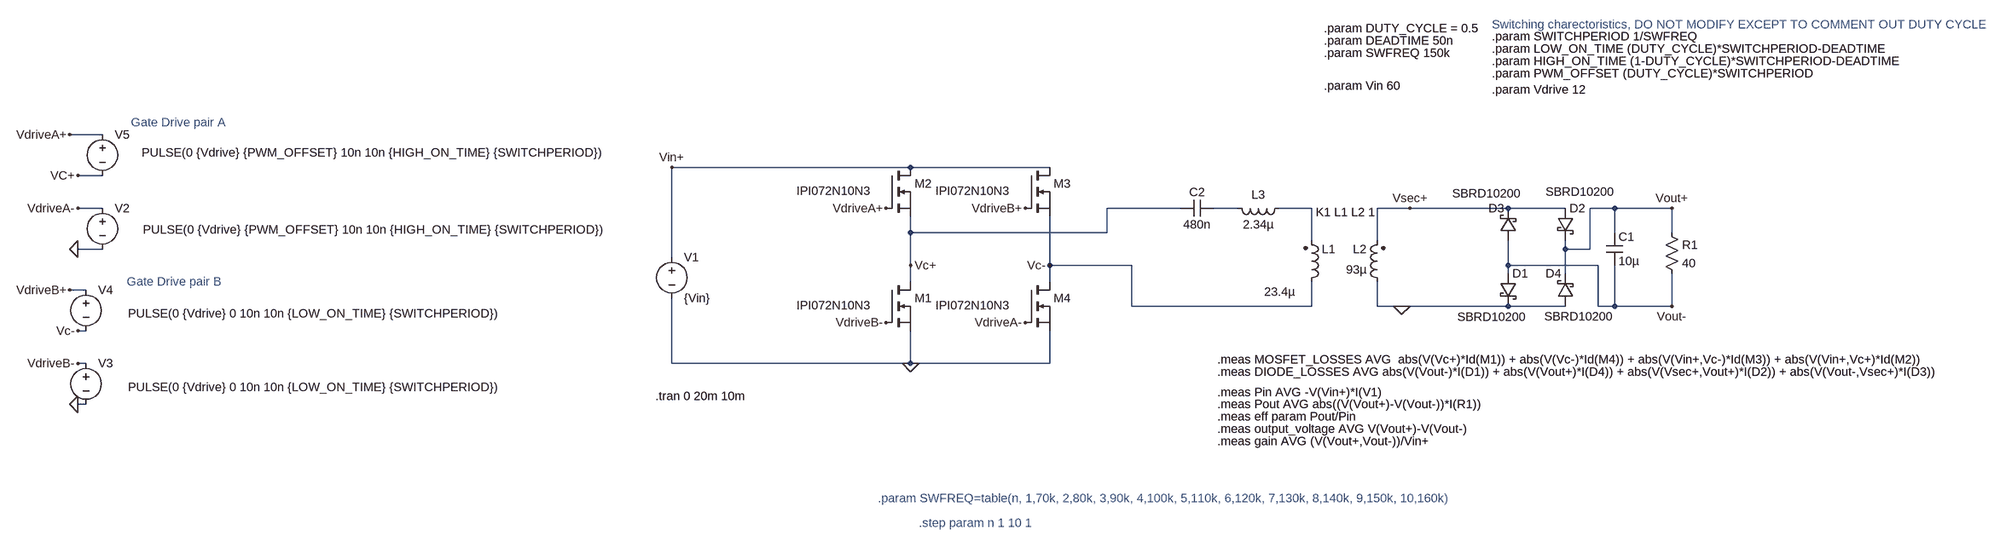
[diagram p0: schematic resonant_full_bridge_ln_10.asc]
resonant_full_bridge_ln_10.asc, the LTspice schematic file:
Version 4
SHEET 1 2776 680
WIRE -2768 -1168 -2832 -1168
WIRE -960 -1104 -1520 -1104
WIRE -688 -1104 -960 -1104
WIRE -2768 -1088 -2816 -1088
WIRE -2768 -1024 -2816 -1024
WIRE -432 -1024 -576 -1024
WIRE -320 -1024 -368 -1024
WIRE -176 -1024 -240 -1024
WIRE 16 -1024 -48 -1024
WIRE 208 -1024 16 -1024
WIRE 320 -1024 208 -1024
WIRE 416 -1024 368 -1024
WIRE 528 -1024 416 -1024
WIRE -960 -976 -960 -1008
WIRE -576 -976 -576 -1024
WIRE -576 -976 -960 -976
WIRE 416 -976 416 -1024
WIRE 528 -976 528 -1024
WIRE -176 -960 -176 -1024
WIRE -48 -960 -48 -1024
WIRE -2768 -944 -2816 -944
WIRE 320 -944 320 -960
WIRE 368 -944 368 -1024
WIRE 368 -944 320 -944
WIRE -1520 -928 -1520 -1104
WIRE -960 -912 -960 -976
WIRE -688 -912 -688 -1008
WIRE -528 -912 -688 -912
WIRE 208 -912 208 -960
WIRE 384 -912 208 -912
WIRE 208 -896 208 -912
WIRE 320 -896 320 -944
WIRE -960 -880 -960 -912
WIRE -688 -880 -688 -912
WIRE -2800 -864 -2832 -864
WIRE -528 -832 -528 -912
WIRE -176 -832 -176 -880
WIRE -176 -832 -528 -832
WIRE -48 -832 -48 -880
WIRE 0 -832 -48 -832
WIRE 208 -832 0 -832
WIRE 320 -832 208 -832
WIRE 384 -832 384 -912
WIRE 416 -832 416 -912
WIRE 416 -832 384 -832
WIRE 528 -832 528 -896
WIRE 528 -832 416 -832
WIRE -2800 -784 -2816 -784
WIRE -2800 -720 -2816 -720
WIRE -1520 -720 -1520 -848
WIRE -960 -720 -960 -784
WIRE -960 -720 -1520 -720
WIRE -688 -720 -688 -784
WIRE -688 -720 -960 -720
WIRE -2800 -640 -2816 -640
FLAG -960 -720 0
FLAG 0 -832 0
FLAG -1520 -1104 Vin+
FLAG 528 -1024 Vout+
FLAG 528 -832 Vout-
FLAG -960 -912 Vc+
FLAG -1008 -1024 VdriveA+
FLAG -736 -800 VdriveA-
FLAG -1008 -800 VdriveB-
FLAG -736 -1024 VdriveB+
FLAG -2816 -640 0
FLAG -2816 -944 0
FLAG -688 -912 Vc-
FLAG -2816 -784 Vc-
FLAG -2816 -1088 VC+
FLAG -2832 -1168 VdriveA+
FLAG -2816 -1024 VdriveA-
FLAG -2816 -720 VdriveB-
FLAG -2832 -864 VdriveB+
FLAG 16 -1024 Vsec+
SYMBOL voltage -1520 -944 R0
WINDOW 123 0 0 Left 0
WINDOW 39 0 0 Left 0
SYMATTR InstName V1
SYMATTR Value {Vin}
SYMBOL nmos -1008 -1104 R0
WINDOW 3 -175 46 Left 2
SYMATTR Value IPI072N10N3
SYMATTR InstName M2
SYMBOL res 512 -992 R0
SYMATTR InstName R1
SYMATTR Value 40
SYMBOL cap 400 -976 R0
SYMATTR InstName C1
SYMATTR Value 10µ
SYMBOL cap -368 -1040 R90
WINDOW 0 0 32 VBottom 2
WINDOW 3 32 32 VTop 2
SYMATTR InstName C2
SYMATTR Value 480n
SYMBOL ind2 -192 -864 M180
WINDOW 0 36 80 Left 2
WINDOW 3 -77 -4 Left 2
SYMATTR InstName L1
SYMATTR Value 23.4µ
SYMATTR Type ind
SYMBOL ind2 -32 -864 R180
WINDOW 0 36 80 Left 2
WINDOW 3 36 40 Left 2
SYMATTR InstName L2
SYMATTR Value 93µ
SYMATTR Type ind
SYMBOL ind -224 -1040 R90
WINDOW 0 5 56 VBottom 2
WINDOW 3 32 56 VTop 2
SYMATTR InstName L3
SYMATTR Value 2.34µ
SYMBOL voltage -2768 -1040 R0
WINDOW 3 79 58 Left 2
WINDOW 123 0 0 Left 0
WINDOW 39 0 0 Left 0
SYMATTR Value PULSE(0 {Vdrive} {PWM_OFFSET} 10n 10n {HIGH_ON_TIME} {SWITCHPERIOD})
SYMATTR InstName V2
SYMBOL voltage -2800 -736 R0
WINDOW 3 82 62 Left 2
WINDOW 123 0 0 Left 0
WINDOW 39 0 0 Left 0
SYMATTR Value PULSE(0 {Vdrive} 0 10n 10n {LOW_ON_TIME} {SWITCHPERIOD})
SYMATTR InstName V3
SYMBOL nmos -1008 -880 R0
WINDOW 3 -175 46 Left 2
SYMATTR Value IPI072N10N3
SYMATTR InstName M1
SYMBOL nmos -736 -1104 R0
WINDOW 3 -175 46 Left 2
SYMATTR Value IPI072N10N3
SYMATTR InstName M3
SYMBOL nmos -736 -880 R0
WINDOW 3 -175 46 Left 2
SYMATTR Value IPI072N10N3
SYMATTR InstName M4
SYMBOL voltage -2800 -880 R0
WINDOW 3 82 62 Left 2
WINDOW 123 0 0 Left 0
WINDOW 39 0 0 Left 0
SYMATTR Value PULSE(0 {Vdrive} 0 10n 10n {LOW_ON_TIME} {SWITCHPERIOD})
SYMATTR InstName V4
SYMBOL voltage -2768 -1184 R0
WINDOW 3 77 51 Left 2
WINDOW 123 0 0 Left 0
WINDOW 39 0 0 Left 0
SYMATTR Value PULSE(0 {Vdrive} {PWM_OFFSET} 10n 10n {HIGH_ON_TIME} {SWITCHPERIOD})
SYMATTR InstName V5
SYMBOL schottky 224 -960 R180
WINDOW 3 -8 93 Left 2
WINDOW 0 24 64 Left 2
SYMATTR Value SBRD10200
SYMATTR InstName D3
SYMATTR Description Diode
SYMATTR Type diode
SYMATTR SpiceLine Bv=200
SYMBOL schottky 192 -896 R0
WINDOW 3 87 84 Left 2
SYMATTR Value SBRD10200
SYMATTR InstName D1
SYMATTR Description Diode
SYMATTR Type diode
SYMATTR SpiceLine Bv=200
SYMBOL schottky 304 -1024 R0
WINDOW 3 -23 -32 Left 2
SYMATTR Value SBRD10200
SYMATTR InstName D2
SYMATTR Description Diode
SYMATTR Type diode
SYMATTR SpiceLine Bv=200
SYMBOL schottky 336 -832 R180
WINDOW 3 94 -21 Left 2
WINDOW 0 24 64 Left 2
SYMATTR Value SBRD10200
SYMATTR InstName D4
SYMATTR Description Diode
SYMATTR Type diode
SYMATTR SpiceLine Bv=200
TEXT -152 -1352 Left 2 !.param DEADTIME 50n
TEXT -152 -1328 Left 2 !.param SWFREQ 150k
TEXT 176 -1360 Left 2 !.param SWITCHPERIOD 1/SWFREQ
TEXT 176 -1336 Left 2 !.param LOW_ON_TIME (DUTY_CYCLE)*SWITCHPERIOD-DEADTIME
TEXT 176 -1312 Left 2 !.param HIGH_ON_TIME (1-DUTY_CYCLE)*SWITCHPERIOD-DEADTIME
TEXT 176 -1288 Left 2 !.param PWM_OFFSET (DUTY_CYCLE)*SWITCHPERIOD
TEXT -152 -1264 Left 2 !.param Vin 60
TEXT -152 -1376 Left 2 !.param DUTY_CYCLE = 0.5
TEXT 176 -1384 Left 2 ;Switching charectoristics, DO NOT MODIFY EXCEPT TO COMMENT OUT DUTY CYCLE
TEXT -168 -1016 Left 2 !K1 L1 L2 1
TEXT 176 -1256 Left 2 !.param Vdrive 12
TEXT -1552 -656 Left 2 !.tran 0 20m 10m
TEXT -944 -408 Left 2 ;.step param n 1 10 1
TEXT -1024 -456 Left 2 ;.param SWFREQ=table(n, 1,70k, 2,80k, 3,90k, 4,100k, 5,110k, 6,120k, 7,130k, 8,140k, 9,150k, 10,160k)
TEXT -360 -664 Left 2 !.meas Pin AVG -V(Vin+)*I(V1)
TEXT -360 -640 Left 2 !.meas Pout AVG abs((V(Vout+)-V(Vout-))*I(R1))
TEXT -360 -616 Left 2 !.meas eff param Pout/Pin
TEXT -2712 -1192 Left 2 ;Gate Drive pair A
TEXT -2720 -880 Left 2 ;Gate Drive pair B
TEXT -360 -704 Left 2 !.meas DIODE_LOSSES AVG abs(V(Vout-)*I(D1)) + abs(V(Vout+)*I(D4)) + abs(V(Vsec+,Vout+)*I(D2)) + abs(V(Vout-,Vsec+)*I(D3))
TEXT -360 -728 Left 2 !.meas MOSFET_LOSSES AVG  abs(V(Vc+)*Id(M1)) + abs(V(Vc-)*Id(M4)) + abs(V(Vin+,Vc-)*Id(M3)) + abs(V(Vin+,Vc+)*Id(M2))
TEXT -360 -592 Left 2 !.meas output_voltage AVG V(Vout+)-V(Vout-)
TEXT -360 -568 Left 2 !.meas gain AVG (V(Vout+,Vout-))/Vin+

The netlist it stands for:
* resonant_full_bridge_ln_10.asc
V1 Vin+ 0 {Vin}
M2 Vin+ VdriveA+ Vc+ Vc+ IPI072N10N3
R1 Vout+ Vout- 40
C1 Vout+ Vout- 10µ
C2 N001 Vc+ 480n
L1 Vc- N002 23.4µ
L2 0 Vsec+ 93µ
L3 N002 N001 2.34µ
V2 VdriveA- 0 PULSE(0 {Vdrive} {PWM_OFFSET} 10n 10n {HIGH_ON_TIME} {SWITCHPERIOD})
V3 VdriveB- 0 PULSE(0 {Vdrive} 0 10n 10n {LOW_ON_TIME} {SWITCHPERIOD})
M1 Vc+ VdriveB- 0 0 IPI072N10N3
M3 Vin+ VdriveB+ Vc- Vc- IPI072N10N3
M4 Vc- VdriveA- 0 0 IPI072N10N3
V4 VdriveB+ Vc- PULSE(0 {Vdrive} 0 10n 10n {LOW_ON_TIME} {SWITCHPERIOD})
V5 VdriveA+ Vc+ PULSE(0 {Vdrive} {PWM_OFFSET} 10n 10n {HIGH_ON_TIME} {SWITCHPERIOD})
D3 Vout- Vsec+ SBRD10200 Bv=200
D1 Vout- 0 SBRD10200 Bv=200
D2 Vsec+ Vout+ SBRD10200 Bv=200
D4 0 Vout+ SBRD10200 Bv=200
.model D D
.lib standard.dio
.model NMOS NMOS
.model PMOS PMOS
.lib standard.mos
.param DEADTIME 50n
.param SWFREQ 150k
.param SWITCHPERIOD 1/SWFREQ
.param LOW_ON_TIME (DUTY_CYCLE)*SWITCHPERIOD-DEADTIME
.param HIGH_ON_TIME (1-DUTY_CYCLE)*SWITCHPERIOD-DEADTIME
.param PWM_OFFSET (DUTY_CYCLE)*SWITCHPERIOD
.param Vin 60
.param DUTY_CYCLE = 0.5
* Switching charectoristics, DO NOT MODIFY EXCEPT TO COMMENT OUT DUTY CYCLE
K1 L1 L2 1
.param Vdrive 12
.tran 0 20m 10m
* .step param n 1 10 1
* .param SWFREQ=table(n, 1,70k, 2,80k, 3,90k, 4,100k, 5,110k, 6,120k, 7,130k, 8,140k, 9,150k, 10,160k)
.meas Pin AVG -V(Vin+)*I(V1)
.meas Pout AVG abs((V(Vout+)-V(Vout-))*I(R1))
.meas eff param Pout/Pin
* Gate Drive pair A
* Gate Drive pair B
.meas DIODE_LOSSES AVG abs(V(Vout-)*I(D1)) + abs(V(Vout+)*I(D4)) + abs(V(Vsec+,Vout+)*I(D2)) + abs(V(Vout-,Vsec+)*I(D3))
.meas MOSFET_LOSSES AVG  abs(V(Vc+)*Id(M1)) + abs(V(Vc-)*Id(M4)) + abs(V(Vin+,Vc-)*Id(M3)) + abs(V(Vin+,Vc+)*Id(M2))
.meas output_voltage AVG V(Vout+)-V(Vout-)
.meas gain AVG (V(Vout+,Vout-))/Vin+
.backanno
.end